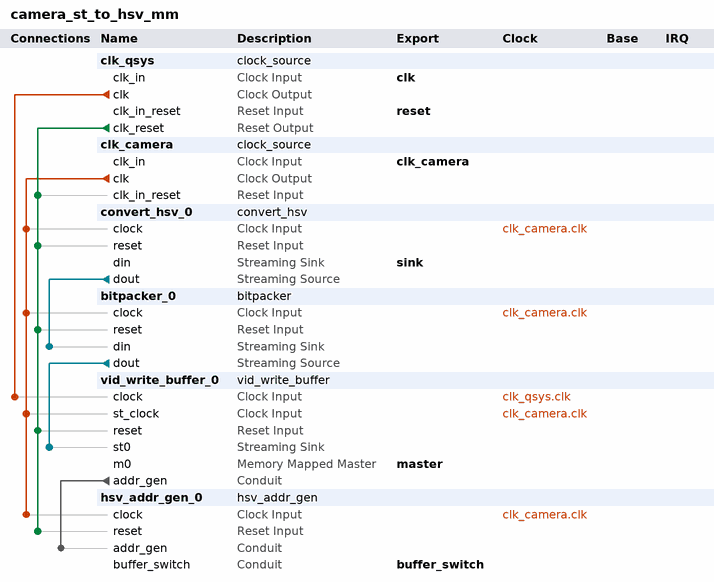
[diagram p0: system contents]
# Platform Designer (Qsys) system camera_st_to_hsv_mm, Cyclone IV GX EP4CGX150DF31C7
# Parameters at their usual value, and those the tool derives, are not listed.
package require -exact qsys 15.0
create_system camera_st_to_hsv_mm
set_project_property DEVICE_FAMILY {Cyclone IV GX}
set_project_property DEVICE EP4CGX150DF31C7

add_instance clk_qsys clock_source 15.0
set_instance_parameter_value clk_qsys clockFrequency 50000000
set_instance_parameter_value clk_qsys clockFrequencyKnown false

add_instance clk_camera clock_source 15.0
set_instance_parameter_value clk_camera clockFrequency 50000000
set_instance_parameter_value clk_camera clockFrequencyKnown false

add_instance convert_hsv_0 convert_hsv 1.0
set_instance_parameter_value convert_hsv_0 PIPELINE 16

add_instance bitpacker_0 bitpacker 1.1
set_instance_parameter_value bitpacker_0 FIRST_SYMBOL_IN_MSB 0
set_instance_parameter_value bitpacker_0 PACK_LENGTH 8

add_instance vid_write_buffer_0 vid_write_buffer 2.0
set_instance_parameter_value vid_write_buffer_0 ADDR_WIDTH 32
set_instance_parameter_value vid_write_buffer_0 DATA_WIDTH 8
set_instance_parameter_value vid_write_buffer_0 FIFO_LENGTH_LOG_2 6

add_instance hsv_addr_gen_0 hsv_addr_gen 1.0
set_instance_parameter_value hsv_addr_gen_0 ADDR_BASE 134217728
set_instance_parameter_value hsv_addr_gen_0 ADDR_WIDTH 32
set_instance_parameter_value hsv_addr_gen_0 HEIGHT 480
set_instance_parameter_value hsv_addr_gen_0 WIDTH 640

# connections
add_connection clk_camera.clk bitpacker_0.clock clock
add_connection clk_camera.clk convert_hsv_0.clock clock
add_connection clk_camera.clk hsv_addr_gen_0.clock clock
add_connection clk_camera.clk vid_write_buffer_0.st_clock clock
add_connection clk_qsys.clk vid_write_buffer_0.clock clock
add_connection clk_qsys.clk_reset bitpacker_0.reset reset
add_connection clk_qsys.clk_reset clk_camera.clk_in_reset reset
add_connection clk_qsys.clk_reset convert_hsv_0.reset reset
add_connection clk_qsys.clk_reset hsv_addr_gen_0.reset reset
add_connection clk_qsys.clk_reset vid_write_buffer_0.reset reset
add_connection bitpacker_0.dout vid_write_buffer_0.st0 avalon_streaming
add_connection convert_hsv_0.dout bitpacker_0.din avalon_streaming
add_connection vid_write_buffer_0.addr_gen hsv_addr_gen_0.addr_gen conduit

# exported interfaces
add_interface buffer_switch conduit end
set_interface_property buffer_switch EXPORT_OF hsv_addr_gen_0.buffer_switch
add_interface clk clock sink
set_interface_property clk EXPORT_OF clk_qsys.clk_in
add_interface clk_camera clock sink
set_interface_property clk_camera EXPORT_OF clk_camera.clk_in
add_interface master avalon master
set_interface_property master EXPORT_OF vid_write_buffer_0.m0
add_interface reset reset sink
set_interface_property reset EXPORT_OF clk_qsys.clk_in_reset
add_interface sink avalon_streaming sink
set_interface_property sink EXPORT_OF convert_hsv_0.din

set_interconnect_requirement {$system} qsys_mm.clockCrossingAdapter HANDSHAKE
set_interconnect_requirement {$system} qsys_mm.enableEccProtection FALSE
set_interconnect_requirement {$system} qsys_mm.insertDefaultSlave FALSE
set_interconnect_requirement {$system} qsys_mm.maxAdditionalLatency 1

save_system camera_st_to_hsv_mm.qsys
